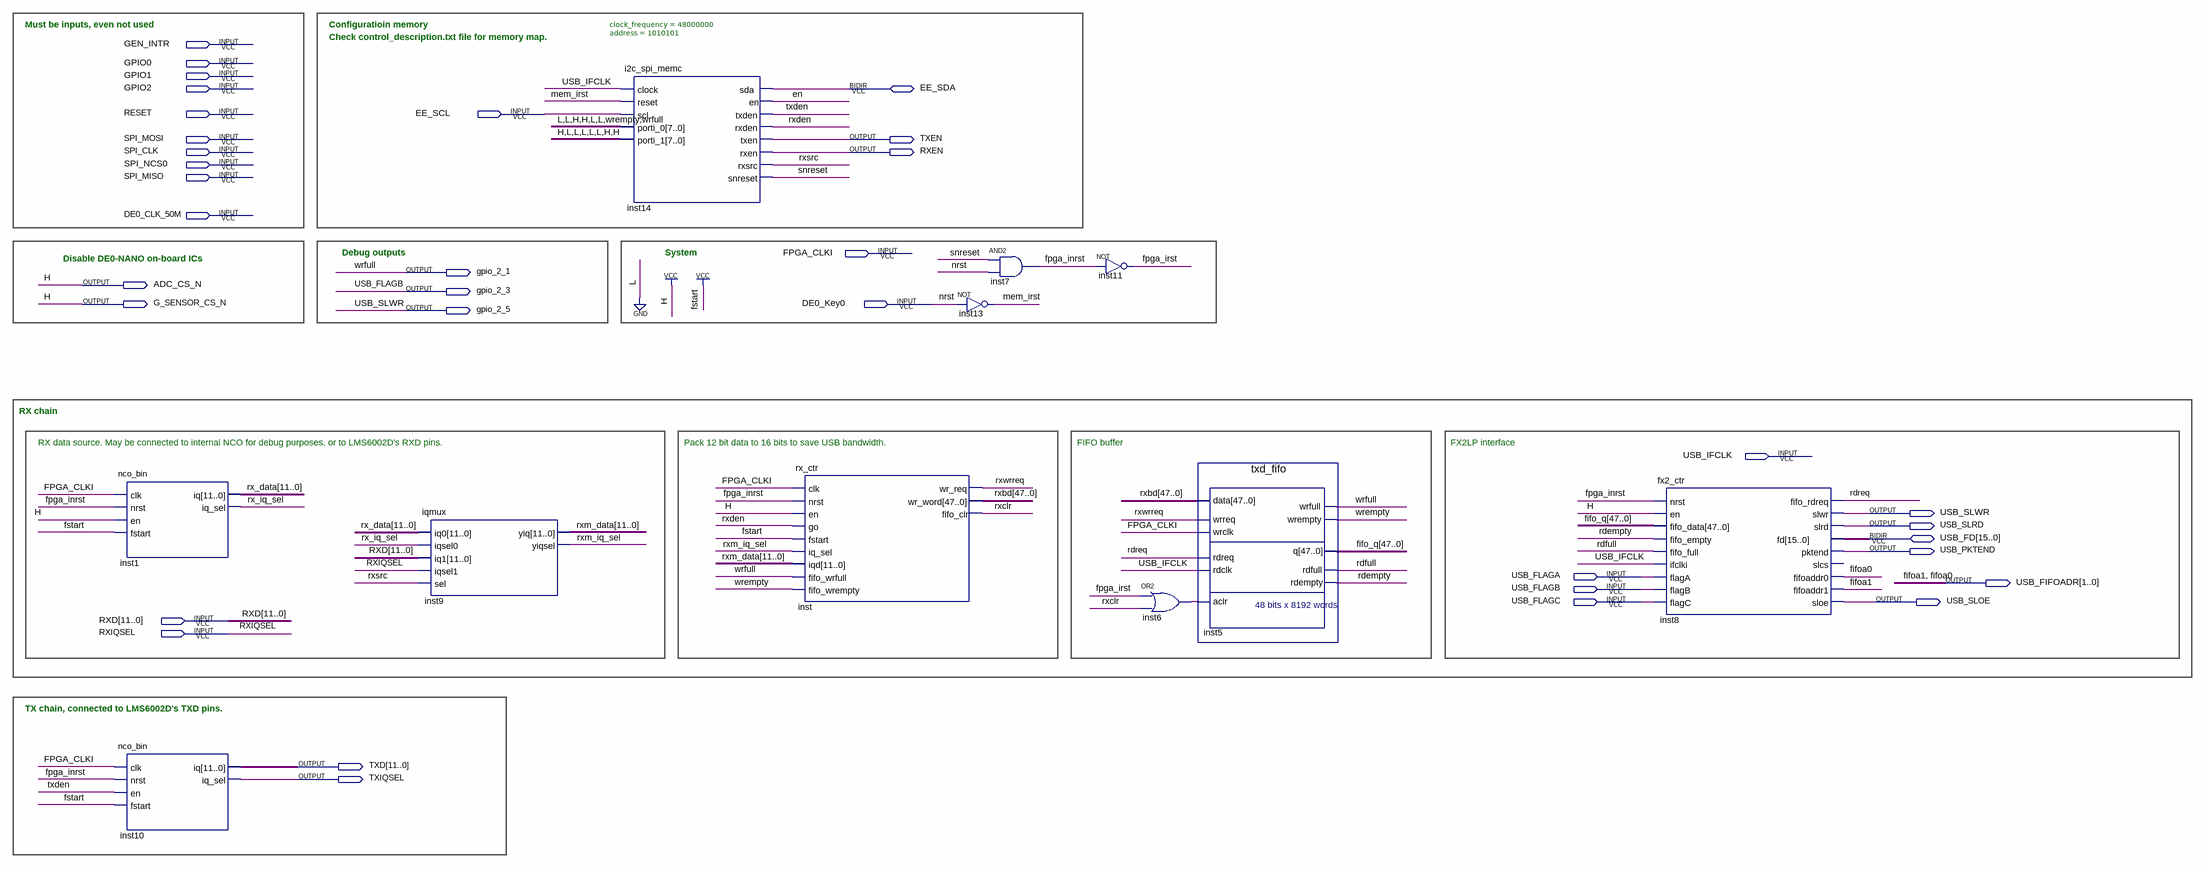
[diagram p0: schematic sheet]
// Quartus schematic rx_acq.bdf as structural Verilog: 11 symbols, 35 pins
module rx_acq (
  input  GEN_INTR,
  input  GPIO0,
  input  GPIO1,
  input  GPIO2,
  input  RESET,
  input  EE_SCL,
  input  SPI_MOSI,
  input  SPI_CLK,
  input  SPI_NCS0,
  input  SPI_MISO,
  input  DE0_CLK_50M,
  input  FPGA_CLKI,
  input  DE0_Key0,
  input  USB_IFCLK,
  input  USB_FLAGA,
  input  USB_FLAGB,
  input  USB_FLAGC,
  input  [11:0] RXD,
  input  RXIQSEL,
  inout  EE_SDA,
  inout  [15:0] USB_FD,
  output TXEN,
  output RXEN,
  output gpio_2_1,
  output ADC_CS_N,
  output gpio_2_3,
  output G_SENSOR_CS_N,
  output gpio_2_5,
  output USB_SLWR,
  output USB_SLRD,
  output USB_PKTEND,
  output [1:0] USB_FIFOADR,
  output USB_SLOE,
  output [11:0] TXD,
  output TXIQSEL
);

  wire en, fpga_inrst, fpga_irst, inst6_out, mem_irst, rdempty, rdfull, rdreq, rx_iq_sel, rxclr, rxden,
       rxm_iq_sel, rxsrc, rxwrreq, snreset, txden, wrempty;
  wire [11:0] rx_data, rxm_data;
  wire [47:0] fifo_q, rxbd;

  nco_bin inst1 (.clk(FPGA_CLKI), .nrst(fpga_inrst), .en(1'b1), .fstart(1'b1), .iq(rx_data), .iq_sel(rx_iq_sel));
  nco_bin inst10 (.clk(FPGA_CLKI), .nrst(fpga_inrst), .en(txden), .fstart(1'b1), .iq(TXD), .iq_sel(TXIQSEL));
  iqmux inst9 (
    .iq0(rx_data), .iqsel0(rx_iq_sel), .iq1(RXD), .iqsel1(RXIQSEL), .sel(rxsrc), .yiq(rxm_data),
    .yiqsel(rxm_iq_sel));
  i2c_spi_memc #(.clock_frequency(48000000), .address(1010101)) inst14 (
    .clock(USB_IFCLK), .reset(mem_irst), .scl(EE_SCL), .porti_0({6'b001100, wrempty, gpio_2_1}),
    .porti_1(8'b10000011), .en(en), .txden(txden), .rxden(rxden), .txen(TXEN), .rxen(RXEN), .rxsrc(rxsrc),
    .snreset(snreset), .sda(EE_SDA));
  rx_ctr inst (
    .clk(FPGA_CLKI), .nrst(fpga_inrst), .en(1'b1), .go(rxden), .fstart(1'b1), .iq_sel(rxm_iq_sel),
    .iqd(rxm_data), .fifo_wrfull(gpio_2_1), .fifo_wrempty(wrempty), .wr_req(rxwrreq), .wr_word(rxbd),
    .fifo_clr(rxclr));
  not inst13 (mem_irst, DE0_Key0);
  and inst7 (fpga_inrst, snreset, DE0_Key0);
  not inst11 (fpga_irst, fpga_inrst);
  or inst6 (inst6_out, fpga_irst, rxclr);
  txd_fifo inst5 (
    .data(rxbd), .wrreq(rxwrreq), .wrclk(FPGA_CLKI), .rdreq(rdreq), .rdclk(USB_IFCLK), .aclr(inst6_out),
    .wrfull(gpio_2_1), .wrempty(wrempty), .q(fifo_q), .rdfull(rdfull), .rdempty(rdempty));
  fx2_ctr inst8 (
    .nrst(fpga_inrst), .en(1'b1), .fifo_data(fifo_q), .fifo_empty(rdempty), .fifo_full(rdfull),
    .ifclki(USB_IFCLK), .flagA(USB_FLAGA), .flagB(USB_FLAGB), .flagC(USB_FLAGC), .fifo_rdreq(rdreq),
    .slwr(gpio_2_5), .slrd(USB_SLRD), .pktend(USB_PKTEND), .fifoaddr0(USB_FIFOADR[0]),
    .fifoaddr1(USB_FIFOADR[1]), .sloe(USB_SLOE), .fd(USB_FD));  // open: slcs

  assign ADC_CS_N = 1'b1;
  assign G_SENSOR_CS_N = 1'b1;
  assign gpio_2_3 = USB_FLAGB;
  assign USB_SLWR = gpio_2_5;

  // Other names for the same wires on the sheet: fifoa0 = USB_FIFOADR[0]; fifoa1 = USB_FIFOADR[1]; nrst = DE0_Key0;
  //   wrfull = gpio_2_1

  // Notes on the sheet:
  //   Must be inputs, even not used
  //   Configuratioin memory
  //   Check control_description.txt file for memory map.
  //   Debug outputs 
  //   System
  //   Disable DE0-NANO on-board ICs
  //   RX chain
  //   RX data source. May be connected to internal NCO for debug purposes, or to LMS6002D's RXD pins.
  //   Pack 12 bit data to 16 bits to save USB bandwidth.
  //   FIFO buffer
  //   FX2LP interface
  //   TX chain, connected to LMS6002D's TXD pins.
endmodule
